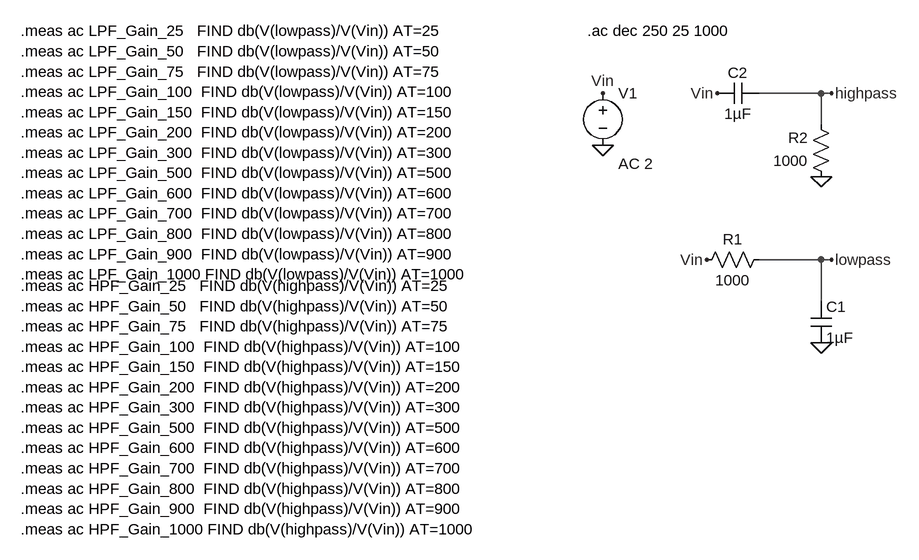
[diagram p0: schematic filters.asc]
filters.asc, the LTspice schematic file:
Version 4
SHEET 1 880 1240
WIRE 496 -160 400 -160
WIRE 512 -160 496 -160
WIRE 496 -112 496 -160
WIRE 496 96 400 96
WIRE 512 96 496 96
WIRE 496 160 496 96
FLAG 160 -80 0
FLAG 496 -32 0
FLAG 496 224 0
FLAG 160 -160 Vin
FLAG 336 -160 Vin
FLAG 320 96 Vin
FLAG 512 -160 highpass
FLAG 512 96 lowpass
SYMBOL voltage 160 -176 R0
WINDOW 123 24 124 Left 2
WINDOW 39 0 0 Left 0
SYMATTR Value2 AC 2
SYMATTR InstName V1
SYMATTR Value ""
SYMBOL res 416 80 R90
WINDOW 0 0 56 VBottom 2
WINDOW 3 32 56 VTop 2
SYMATTR InstName R1
SYMATTR Value 1000
SYMBOL res 512 -16 R180
WINDOW 0 36 76 Left 2
WINDOW 3 36 40 Left 2
SYMATTR InstName R2
SYMATTR Value 1000
SYMBOL cap 480 160 R0
SYMATTR InstName C1
SYMATTR Value 1µF
SYMBOL cap 400 -176 R90
WINDOW 0 0 32 VBottom 2
WINDOW 3 32 32 VTop 2
SYMATTR InstName C2
SYMATTR Value 1µF
TEXT 136 -256 Left 2 !.ac dec 250 25 1000
TEXT -736 -256 Left 2 !.meas ac LPF_Gain_25   FIND db(V(lowpass)/V(Vin)) AT=25\n.meas ac LPF_Gain_50   FIND db(V(lowpass)/V(Vin)) AT=50\n.meas ac LPF_Gain_75   FIND db(V(lowpass)/V(Vin)) AT=75\n.meas ac LPF_Gain_100  FIND db(V(lowpass)/V(Vin)) AT=100\n.meas ac LPF_Gain_150  FIND db(V(lowpass)/V(Vin)) AT=150\n.meas ac LPF_Gain_200  FIND db(V(lowpass)/V(Vin)) AT=200\n.meas ac LPF_Gain_300  FIND db(V(lowpass)/V(Vin)) AT=300\n.meas ac LPF_Gain_500  FIND db(V(lowpass)/V(Vin)) AT=500\n.meas ac LPF_Gain_600  FIND db(V(lowpass)/V(Vin)) AT=600\n.meas ac LPF_Gain_700  FIND db(V(lowpass)/V(Vin)) AT=700\n.meas ac LPF_Gain_800  FIND db(V(lowpass)/V(Vin)) AT=800\n.meas ac LPF_Gain_900  FIND db(V(lowpass)/V(Vin)) AT=900\n.meas ac LPF_Gain_1000 FIND db(V(lowpass)/V(Vin)) AT=1000
TEXT -736 136 Left 2 !.meas ac HPF_Gain_25   FIND db(V(highpass)/V(Vin)) AT=25\n.meas ac HPF_Gain_50   FIND db(V(highpass)/V(Vin)) AT=50\n.meas ac HPF_Gain_75   FIND db(V(highpass)/V(Vin)) AT=75\n.meas ac HPF_Gain_100  FIND db(V(highpass)/V(Vin)) AT=100\n.meas ac HPF_Gain_150  FIND db(V(highpass)/V(Vin)) AT=150\n.meas ac HPF_Gain_200  FIND db(V(highpass)/V(Vin)) AT=200\n.meas ac HPF_Gain_300  FIND db(V(highpass)/V(Vin)) AT=300\n.meas ac HPF_Gain_500  FIND db(V(highpass)/V(Vin)) AT=500\n.meas ac HPF_Gain_600  FIND db(V(highpass)/V(Vin)) AT=600\n.meas ac HPF_Gain_700  FIND db(V(highpass)/V(Vin)) AT=700\n.meas ac HPF_Gain_800  FIND db(V(highpass)/V(Vin)) AT=800\n.meas ac HPF_Gain_900  FIND db(V(highpass)/V(Vin)) AT=900\n.meas ac HPF_Gain_1000 FIND db(V(highpass)/V(Vin)) AT=1000

The netlist it stands for:
* filters.asc
V1 Vin 0 AC 2
R1 lowpass Vin 1000
R2 0 highpass 1000
C1 lowpass 0 1µF
C2 highpass Vin 1µF
.ac dec 250 25 1000
.meas ac LPF_Gain_25   FIND db(V(lowpass)/V(Vin)) AT=25
.meas ac LPF_Gain_50   FIND db(V(lowpass)/V(Vin)) AT=50
.meas ac LPF_Gain_75   FIND db(V(lowpass)/V(Vin)) AT=75
.meas ac LPF_Gain_100  FIND db(V(lowpass)/V(Vin)) AT=100
.meas ac LPF_Gain_150  FIND db(V(lowpass)/V(Vin)) AT=150
.meas ac LPF_Gain_200  FIND db(V(lowpass)/V(Vin)) AT=200
.meas ac LPF_Gain_300  FIND db(V(lowpass)/V(Vin)) AT=300
.meas ac LPF_Gain_500  FIND db(V(lowpass)/V(Vin)) AT=500
.meas ac LPF_Gain_600  FIND db(V(lowpass)/V(Vin)) AT=600
.meas ac LPF_Gain_700  FIND db(V(lowpass)/V(Vin)) AT=700
.meas ac LPF_Gain_800  FIND db(V(lowpass)/V(Vin)) AT=800
.meas ac LPF_Gain_900  FIND db(V(lowpass)/V(Vin)) AT=900
.meas ac LPF_Gain_1000 FIND db(V(lowpass)/V(Vin)) AT=1000
.meas ac HPF_Gain_25   FIND db(V(highpass)/V(Vin)) AT=25
.meas ac HPF_Gain_50   FIND db(V(highpass)/V(Vin)) AT=50
.meas ac HPF_Gain_75   FIND db(V(highpass)/V(Vin)) AT=75
.meas ac HPF_Gain_100  FIND db(V(highpass)/V(Vin)) AT=100
.meas ac HPF_Gain_150  FIND db(V(highpass)/V(Vin)) AT=150
.meas ac HPF_Gain_200  FIND db(V(highpass)/V(Vin)) AT=200
.meas ac HPF_Gain_300  FIND db(V(highpass)/V(Vin)) AT=300
.meas ac HPF_Gain_500  FIND db(V(highpass)/V(Vin)) AT=500
.meas ac HPF_Gain_600  FIND db(V(highpass)/V(Vin)) AT=600
.meas ac HPF_Gain_700  FIND db(V(highpass)/V(Vin)) AT=700
.meas ac HPF_Gain_800  FIND db(V(highpass)/V(Vin)) AT=800
.meas ac HPF_Gain_900  FIND db(V(highpass)/V(Vin)) AT=900
.meas ac HPF_Gain_1000 FIND db(V(highpass)/V(Vin)) AT=1000
.backanno
.end

* Results of the author's LTspice run, read from the files saved beside the schematic
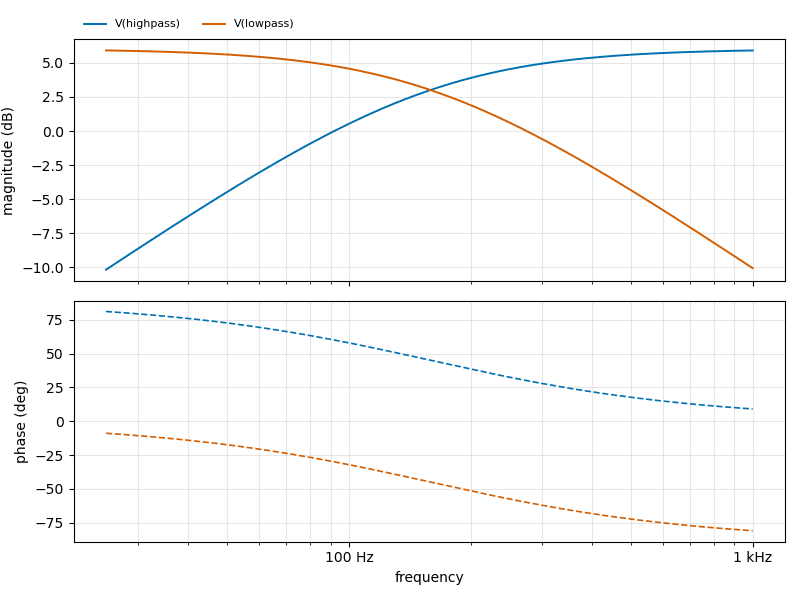
[diagram p1: AC Analysis of filters.asc, plotted from the saved traces]
* AC Analysis, 1 run:
*   V(highpass): -10.16 dB at 25 Hz, 5.91 dB at 1 kHz, peak 5.91 dB at 1 kHz, 3 dB below the peak at 155.3 Hz
*   V(lowpass): 5.91 dB at 25 Hz, -10.05 dB at 1 kHz, peak 5.91 dB at 25 Hz, 3 dB below the peak at 163 Hz
* From the log:
*   lpf_gain_25: db(v(lowpass)/v(vin))=(2.65449dB,-94.4726°) at 25
*   lpf_gain_50: db(v(lowpass)/v(vin))=(8.54764dB,-98.7889°) at 50
*   lpf_gain_75: db(v(lowpass)/v(vin))=(11.8722dB,-102.827°) at 75
*   lpf_gain_100: db(v(lowpass)/v(vin))=(14.1213dB,-106.519°) at 100
*   lpf_gain_150: db(v(lowpass)/v(vin))=(17.0515dB,-112.808°) at 150
*   lpf_gain_200: db(v(lowpass)/v(vin))=(18.9129dB,-117.797°) at 200
*   lpf_gain_300: db(v(lowpass)/v(vin))=(21.2001dB,-124.984°) at 300
*   lpf_gain_500: db(v(lowpass)/v(vin))=(23.5726dB,-133.375°) at 500
*   lpf_gain_600: db(v(lowpass)/v(vin))=(24.306dB,-136.062°) at 600
*   lpf_gain_700: db(v(lowpass)/v(vin))=(24.8874dB,-138.192°) at 700
*   lpf_gain_800: db(v(lowpass)/v(vin))=(25.3654dB,-139.934°) at 800
*   lpf_gain_900: db(v(lowpass)/v(vin))=(25.7689dB,-141.391°) at 900
*   lpf_gain_1000: db(v(lowpass)/v(vin))=(26.1166dB,-142.634°) at 1000
*   hpf_gain_25: db(v(highpass)/v(vin))=(26.1591dB,142.785°) at 25
*   hpf_gain_50: db(v(highpass)/v(vin))=(23.6273dB,133.575°) at 50
*   hpf_gain_75: db(v(highpass)/v(vin))=(21.7972dB,127.027°) at 75
*   hpf_gain_100: db(v(highpass)/v(vin))=(20.2931dB,122.004°) at 100
*   hpf_gain_150: db(v(highpass)/v(vin))=(17.8419dB,114.829°) at 150
*   hpf_gain_200: db(v(highpass)/v(vin))=(15.8688dB,110.049°) at 200
*   hpf_gain_300: db(v(highpass)/v(vin))=(12.8125dB,104.263°) at 300
*   hpf_gain_500: db(v(highpass)/v(vin))=(8.6574dB,98.8998°) at 500
*   hpf_gain_600: db(v(highpass)/v(vin))=(7.12597dB,97.4702°) at 600
*   hpf_gain_700: db(v(highpass)/v(vin))=(5.81926dB,96.4317°) at 700
*   hpf_gain_800: db(v(highpass)/v(vin))=(4.68057dB,95.6443°) at 800
*   hpf_gain_900: db(v(highpass)/v(vin))=(3.67203dB,95.0272°) at 900
*   hpf_gain_1000: db(v(highpass)/v(vin))=(2.76733dB,94.531°) at 1000